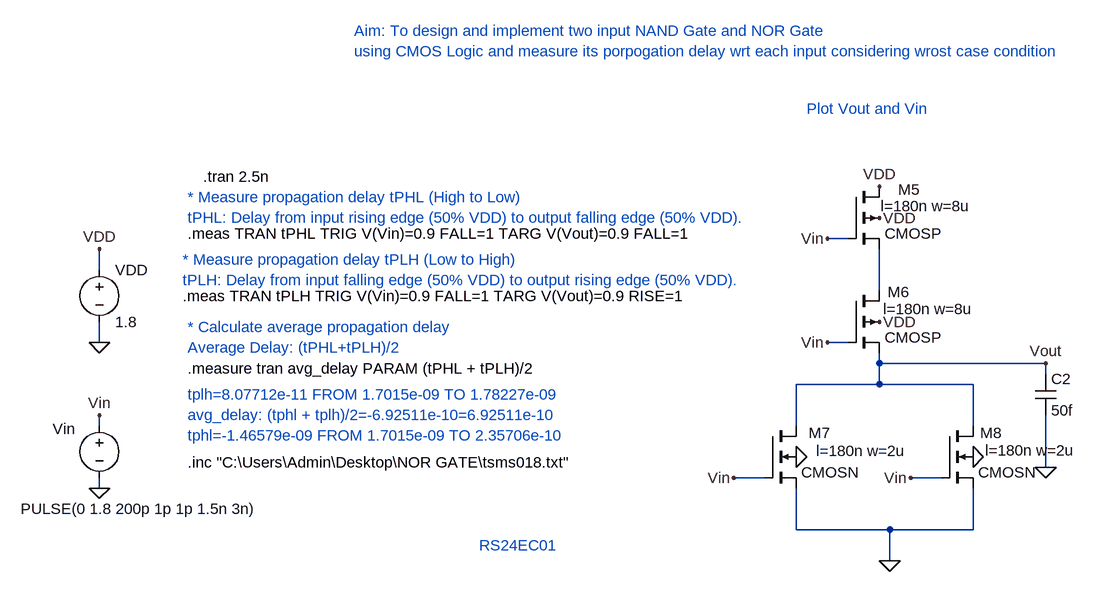
[diagram p0: schematic CMOS_NOR_GATE.asc]
CMOS_NOR_GATE.asc, the LTspice schematic file:
Version 4
SHEET 1 3764 680
WIRE 2688 -528 2656 -528
WIRE 1536 -480 1536 -512
WIRE 2736 -448 2736 -512
WIRE 1536 -368 1536 -400
WIRE 2688 -368 2656 -368
WIRE 2736 -336 2736 -352
WIRE 2992 -336 2736 -336
WIRE 2992 -320 2992 -336
WIRE 2736 -304 2736 -336
WIRE 2736 -304 2608 -304
WIRE 2880 -304 2736 -304
WIRE 1536 -240 1536 -256
WIRE 2608 -240 2608 -304
WIRE 2880 -240 2880 -304
WIRE 2992 -176 2992 -256
WIRE 2560 -160 2512 -160
WIRE 2832 -160 2784 -160
WIRE 1536 -144 1536 -160
WIRE 2608 -80 2608 -144
WIRE 2752 -80 2608 -80
WIRE 2880 -80 2880 -144
WIRE 2880 -80 2752 -80
WIRE 2752 -32 2752 -80
FLAG 1536 -144 0
FLAG 1536 -256 Vin
FLAG 1536 -368 0
FLAG 1536 -512 VDD
FLAG 2752 -32 0
FLAG 2736 -608 VDD
FLAG 2736 -560 VDD
FLAG 2736 -400 VDD
FLAG 2608 -192 0
FLAG 2880 -192 0
FLAG 2656 -528 Vin
FLAG 2512 -160 Vin
FLAG 2656 -368 Vin
FLAG 2784 -160 Vin
FLAG 2992 -176 0
FLAG 2992 -336 Vout
SYMBOL voltage 1536 -256 R0
WINDOW 0 -72 21 Left 2
WINDOW 3 -121 144 Left 2
WINDOW 123 0 0 Left 2
WINDOW 39 0 0 Left 2
SYMATTR InstName Vin
SYMATTR Value PULSE(0 1.8 200p 1p 1p 1.5n 3n)
SYMBOL voltage 1536 -496 R0
WINDOW 123 0 0 Left 2
WINDOW 39 0 0 Left 2
SYMATTR InstName VDD
SYMATTR Value 1.8
SYMBOL pmos4 2688 -608 R0
WINDOW 0 77 4 Left 2
WINDOW 123 50 30 Left 2
SYMATTR InstName M5
SYMATTR Value2 l=180n w=8u
SYMATTR Value CMOSP
SYMBOL pmos4 2688 -448 R0
WINDOW 0 61 2 Left 2
WINDOW 123 54 28 Left 2
SYMATTR InstName M6
SYMATTR Value2 l=180n w=8u
SYMATTR Value CMOSP
SYMBOL nmos4 2560 -240 R0
WINDOW 0 67 11 Left 2
WINDOW 123 79 39 Left 2
SYMATTR InstName M7
SYMATTR Value2 l=180n w=2u
SYMATTR Value CMOSN
SYMBOL nmos4 2832 -240 R0
WINDOW 0 59 11 Left 2
WINDOW 123 67 38 Left 2
SYMATTR InstName M8
SYMATTR Value2 l=180n w=2u
SYMATTR Value CMOSN
SYMBOL cap 2976 -320 R0
SYMATTR InstName C2
SYMATTR Value 50f
TEXT 1696 -624 Left 2 !.tran 2.5n
TEXT 1672 -184 Left 2 !.inc "C:\\Users\\Admin\\Desktop\\NOR GATE\\tsms018.txt"
TEXT 2624 -728 Left 2 ;Plot Vout and Vin
TEXT 1664 -440 Left 2 !.meas TRAN tPLH TRIG V(Vin)=0.9 FALL=1 TARG V(Vout)=0.9 RISE=1
TEXT 1672 -328 Left 2 !.measure tran avg_delay PARAM (tPHL + tPLH)/2
TEXT 1672 -592 Left 2 ;* Measure propagation delay tPHL (High to Low)\ntPHL: Delay from input rising edge (50% VDD) to output falling edge (50% VDD).
TEXT 1664 -496 Left 2 ;* Measure propagation delay tPLH (Low to High)\ntPLH: Delay from input falling edge (50% VDD) to output rising edge (50% VDD).
TEXT 1672 -392 Left 2 ;* Calculate average propagation delay\nAverage Delay: (tPHL+tPLH)/2
TEXT 1928 -848 Left 2 ;Aim: To design and implement two input NAND Gate and NOR Gate \nusing CMOS Logic and measure its porpogation delay wrt each input considering wrost case condition
TEXT 2120 -56 Left 2 ;RS24EC01
TEXT 1672 -536 Left 2 !.meas TRAN tPHL TRIG V(Vin)=0.9 FALL=1 TARG V(Vout)=0.9 FALL=1
TEXT 1672 -288 Left 2 ;tplh=8.07712e-11 FROM 1.7015e-09 TO 1.78227e-09\navg_delay: (tphl + tplh)/2=-6.92511e-10=6.92511e-10\ntphl=-1.46579e-09 FROM 1.7015e-09 TO 2.35706e-10

The netlist it stands for:
* CMOS_NOR_GATE.asc
Vin Vin 0 PULSE(0 1.8 200p 1p 1p 1.5n 3n)
VDD VDD 0 1.8
M5 VDD Vin N001 VDD CMOSP l=180n w=8u
M6 N001 Vin Vout VDD CMOSP l=180n w=8u
M7 Vout Vin 0 0 CMOSN l=180n w=2u
M8 Vout Vin 0 0 CMOSN l=180n w=2u
C2 Vout 0 50f
.model NMOS NMOS
.model PMOS PMOS
.lib standard.mos
.tran 2.5n
.inc "C:\Users\Admin\Desktop\NOR GATE\tsms018.txt"
* Plot Vout and Vin
.meas TRAN tPLH TRIG V(Vin)=0.9 FALL=1 TARG V(Vout)=0.9 RISE=1
.measure tran avg_delay PARAM (tPHL + tPLH)/2
* * Measure propagation delay tPHL (High to Low)
* tPHL: Delay from input rising edge (50% VDD) to output falling edge (50% VDD).
* * Measure propagation delay tPLH (Low to High)
* tPLH: Delay from input falling edge (50% VDD) to output rising edge (50% VDD).
* * Calculate average propagation delay
* Average Delay: (tPHL+tPLH)/2
* Aim: To design and implement two input NAND Gate and NOR Gate
* using CMOS Logic and measure its porpogation delay wrt each input considering wrost case condition
* RS24EC01
.meas TRAN tPHL TRIG V(Vin)=0.9 FALL=1 TARG V(Vout)=0.9 FALL=1
* tplh=8.07712e-11 FROM 1.7015e-09 TO 1.78227e-09
* avg_delay: (tphl + tplh)/2=-6.92511e-10=6.92511e-10
* tphl=-1.46579e-09 FROM 1.7015e-09 TO 2.35706e-10
.backanno
.end

* Results of the author's LTspice run, read from the files saved beside the schematic
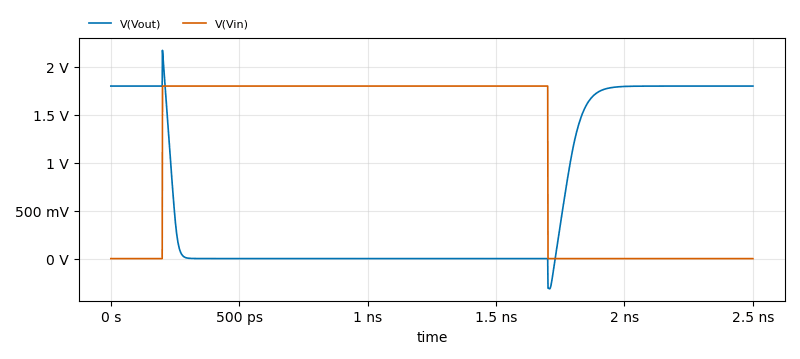
[diagram p1: Transient Analysis of CMOS_NOR_GATE.asc, plotted from the saved traces]
* Transient Analysis, 1 run:
*   V(Vout): min -315 mV, max 2.172 V, average 679.3 mV, rms 1.088 V, last 1.8 V
*   V(Vin): min 0 V, max 1.8 V, average 1.081 V, rms 1.395 V, last 0 V
* From the log:
*   tplh=8.07712e-11 FROM 1.7015e-09 TO 1.78227e-09
*   avg_delay: (tphl + tplh)/2=-6.92511e-10
*   tphl=-1.46579e-09 FROM 1.7015e-09 TO 2.35706e-10